# EasyEDA Pro project stripdriver.eprj

# Schematic Schematic
Board Name: StripDriverBoard; Create Date: 2024-08-19; Project Name: stripdriver; Schematic Name: Schematic; Update Date: 2024-09-09; Company: Krzysztof Strehlau; Drawn: Krzysztof Strehlau; Part Number: LSDR202409A; Reviewed: Krzysztof Strehlau; Version: R202408A
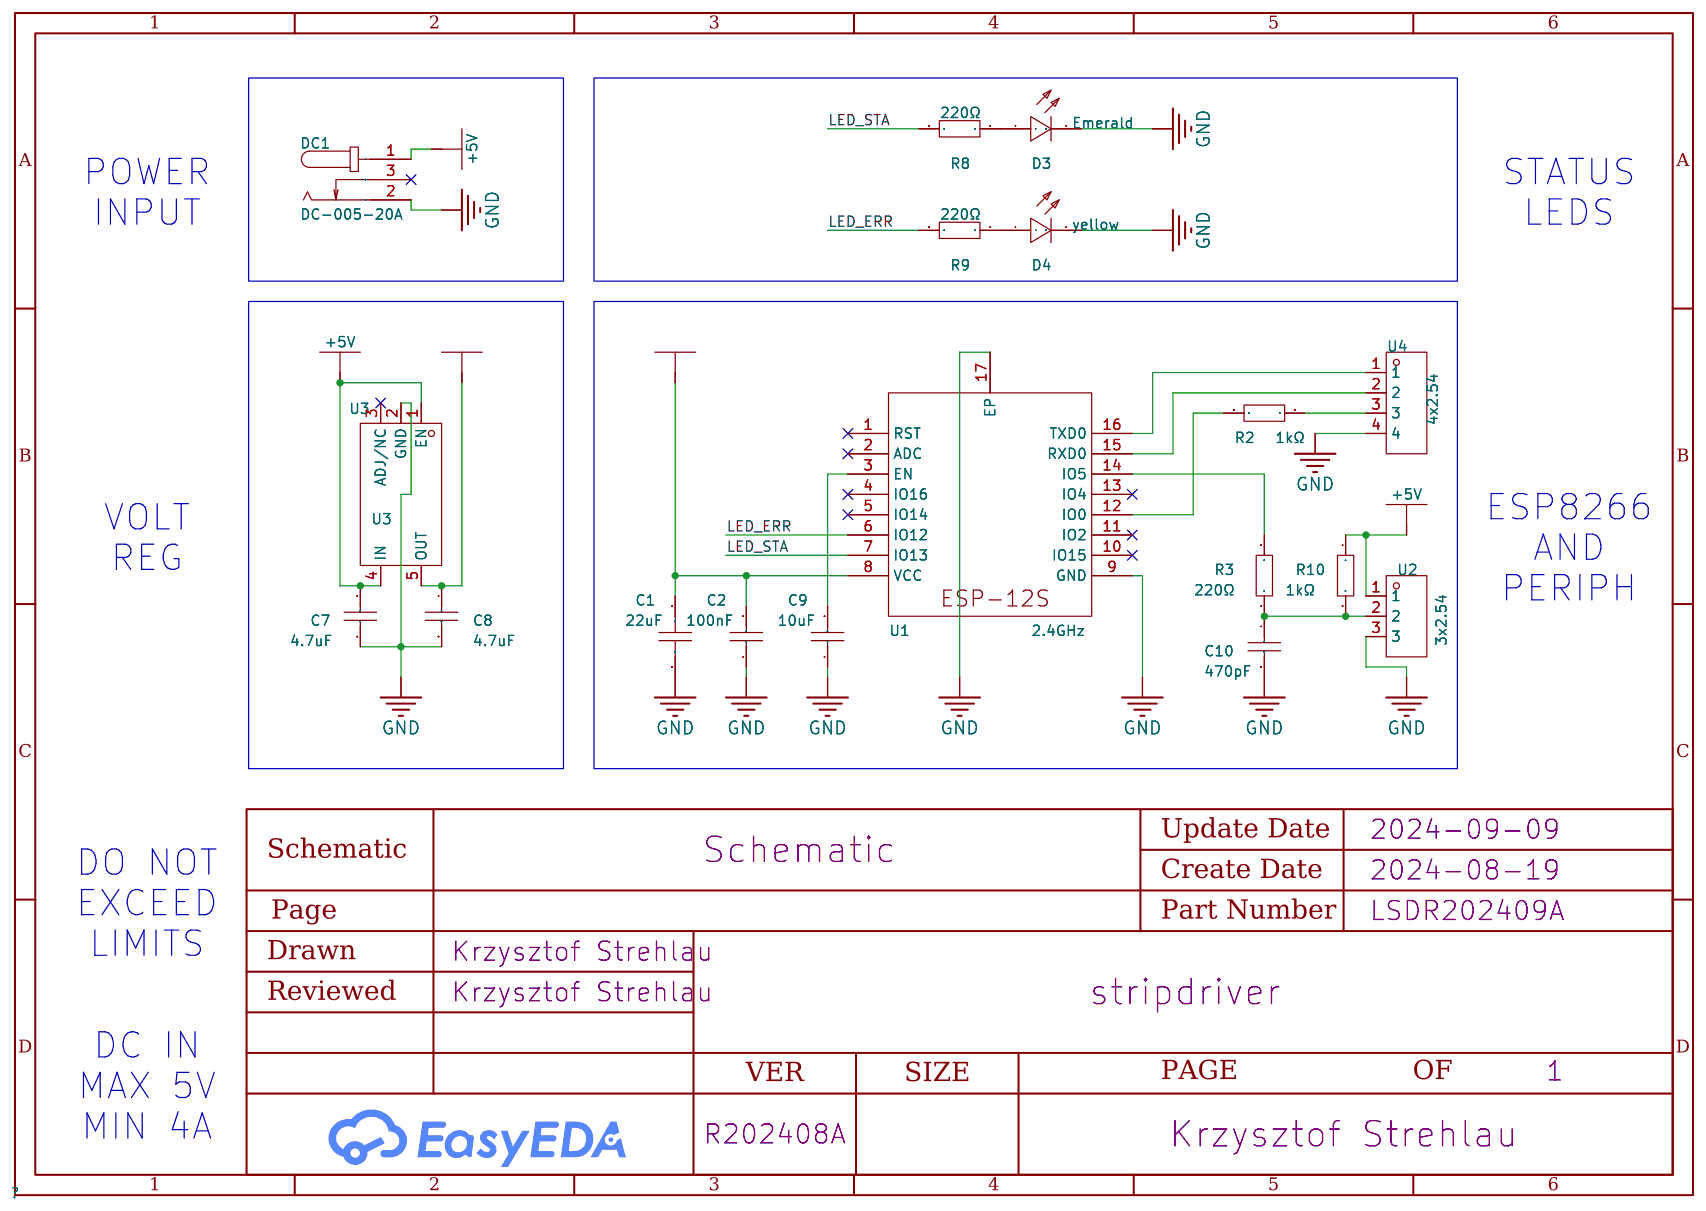
[diagram p0: schematic sheet]

## Parts
C1  22uF  [C0805]
C2  100nF  [C0603]
C7  4.7uF  [C0805]
C8  4.7uF  [C0805]
C9  10uF  [C0805]
C10  470pF  [C0603]
D3  Emerald  [LED0603-R-RD]
D4  yellow  [LED0603-R-RD]
DC1  DC-005-20A  [DC-IN-TH_DC005]
R2  1kΩ  [R0603]
R3  220Ω  [R0603]
R8  220Ω  [R0603]
R9  220Ω  [R0603]
R10  1kΩ  [R0603]
U1  2.4GHz  [WIRELM-SMD_ESP-12S]
U2  3x2.54  [CONN-TH_DB125-2.54-3P-GN]
U3  U3  [SOT-89-5_L4.5-W2.5-P1.50-LS4.5-BR]
U4  4x2.54  [CONN-TH_DB125-2.54-4P-GN]

## Library data of the parts
C1 = CL21A226MAQNNNE_C45783: Capacitance: Tolerance:±20% Tolerance:±20% Voltage Rated: Temperature Coefficient:; LCSC Part Name: 22uF ±20% 25V; Supplier Part: C45783; Manufacturer: SAMSUNG(三星); Manufacturer Part: CL21A226MAQNNNE; Supplier Footprint: 0805; JLCPCB Part Class: Basic Part; Datasheet: https://atta.szlcsc.com/upload/public/pdf/source/20160103/1457707727161.pdf; Supplier: LCSC; Tolerance: ±20%; Check: true
C2 C10 = CC0603KRX7R9BB104: Capacitance: Tolerance:±10% Tolerance:±10% Voltage Rated: Temperature Coefficient:; LCSC Part Name: 100nF ±10% 50V; Supplier Part: C14663; Manufacturer: YAGEO(国巨); Supplier Footprint: 0603; JLCPCB Part Class: Basic Part; Datasheet: https://atta.szlcsc.com/upload/public/pdf/source/20170116/1484561234239.pdf; Supplier: LCSC; Tolerance: ±10%; Check: true
C7-C9 = CL21A475KAQNNNE: Capacitance: Tolerance:±10% Tolerance:±10% Voltage Rated: Temperature Coefficient:; LCSC Part Name: 4.7uF ±10% 25V; Supplier Part: C1779; Manufacturer: SAMSUNG(三星); Supplier Footprint: 0805; JLCPCB Part Class: Basic Part; Datasheet: https://atta.szlcsc.com/upload/public/pdf/source/20160103/1457707696447.pdf; Supplier: LCSC; Tolerance: ±10%; Check: true
D3 = 19-217/GHC-YR1S2/3T: LCSC Part Name: 翠绿 520nm~535nm; Supplier Part: C72043; Manufacturer: EVERLIGHT(亿光); Supplier Footprint: 0603; JLCPCB Part Class: Basic Part; Datasheet: https://atta.szlcsc.com/upload/public/pdf/source/20160507/1462613613780.pdf; Supplier: LCSC; Lens Color: Colorless transparence; Dominant Wavelength: 520nm~535nm; Peak Wavelength: 518nm; Forward Current: 20mA; Power Dissipation: 110mW; Viewing Angle: 120°; Operating Temperature: -40℃~+85℃; Check: true
D4 = 19-213/Y2C-CQ2R2L/3T(CY): Emitted Color:yellow Diode Configuration:- Lens Color:Colorless transparence Dominant Wavelength:585.5nm~591.5nm Dominant Wavelength:585.5nm~591.5nm Peak Wavelength:591nm Color Temperature:- Color Temperature:- Forward Current:20mA Power Dissipation:60mW; LCSC Part Name: 黄灯 585.5nm~591.5nm; Supplier Part: C72038; Manufacturer: EVERLIGHT(亿光); Supplier Footprint: 0603; JLCPCB Part Class: Basic Part; Datasheet: https://atta.szlcsc.com/upload/public/pdf/source/20160507/1462613613586.pdf; Supplier: LCSC; Lens Color: Colorless transparence; Dominant Wavelength: 585.5nm~591.5nm; Peak Wavelength: 591nm; Forward Current: 20mA; Power Dissipation: 60mW; Viewing Angle: 120°; Operating Temperature: -40℃~+85℃; Check: true
DC1 = DC-005-20A: Inside Contact Diameter:2mm Outside Contact Diameter:6.4mm Current Rating (Max):500mA Voltage Rating (Max):30V; LCSC Part Name: 内径:2mm 外径:6.4mm; Supplier Part: C130239; Manufacturer: 韩国韩荣; Supplier Footprint: 插件; JLCPCB Part Class: Extended Part; Datasheet: https://atta.szlcsc.com/upload/public/pdf/source/20210810/D1FE451D887B1804F0660F580C4AD849.pdf; Supplier: LCSC; Inside Contact Diameter: 2mm; Outside Contact Diameter: 6.4mm; Current Rating (Max): 500mA; Voltage Rating (Max): 30V
R2 = 0603WAF1001T5E: Type:Thick Film Resistors Resistance:1kΩ Tolerance:±1% Tolerance:±1% Power(Watts): Overload Voltage (Max): Temperature Coefficient:±100ppm/℃ Temperature Coefficient:±100ppm/℃ Operating Temperature Range:-55℃~+155℃ Operating Temperature Range:-55℃~+155℃; LCSC Part Name: 1kΩ ±1% 100mW 厚膜电阻; Supplier Part: C21190; Manufacturer: UNI-ROYAL(厚声); Supplier Footprint: 0603; JLCPCB Part Class: Basic Part; Datasheet: https://atta.szlcsc.com/upload/public/pdf/source/20200306/C422600_1E6D84923E4A46A82E41ADD87F860B5C.pdf; Supplier: LCSC; Type: Thick Film Resistors; Tolerance: ±1%; Temperature Coefficient: ±100ppm/℃; Operating Temperature Range: -55℃~+155℃; Check: true
R3 R10 = 0603WAF1002T5E: Type:Thick Film Resistors Resistance: Tolerance:±1% Tolerance:±1% Power(Watts): Temperature Coefficient:±100ppm/℃ Temperature Coefficient:±100ppm/℃ Overload Voltage (Max): Operating Temperature Range:-55℃~+155℃ Operating Temperature Range:-55℃~+155℃; LCSC Part Name: 10kΩ ±1% 100mW; Supplier Part: C25804; Manufacturer: UNI-ROYAL(厚声); Supplier Footprint: 0603; JLCPCB Part Class: Basic Part; Datasheet: https://atta.szlcsc.com/upload/public/pdf/source/20200306/C422600_1E6D84923E4A46A82E41ADD87F860B5C.pdf; Supplier: LCSC; Type: Thick Film Resistors; Tolerance: ±1%; Temperature Coefficient: ±100ppm/℃; Operating Temperature Range: -55℃~+155℃; Check: true
R8 R9 = 0603WAF2200T5E: Type:Thick Film Resistors Resistance: Tolerance:±1% Tolerance:±1% Power(Watts): Temperature Coefficient:±100ppm/℃ Temperature Coefficient:±100ppm/℃ Overload Voltage (Max): Operating Temperature Range:-55℃~+155℃ Operating Temperature Range:-55℃~+155℃; LCSC Part Name: 220Ω ±1% 100mW; Supplier Part: C22962; Manufacturer: UNI-ROYAL(厚声); Supplier Footprint: 0603; JLCPCB Part Class: Basic Part; Datasheet: https://atta.szlcsc.com/upload/public/pdf/source/20200306/C422600_1E6D84923E4A46A82E41ADD87F860B5C.pdf; Supplier: LCSC; Type: Thick Film Resistors; Tolerance: ±1%; Temperature Coefficient: ±100ppm/℃; Operating Temperature Range: -55℃~+155℃; Check: true
U1 = ESP-12S: Core Processor:ESP8266芯片 Wireless Standard:802.11b/g/n；IP；TCP Support Interface:GPIO；UART；PWM；ADC Frequency:2.4GHz Antenna Type:板载PCBAntenna Output Power:16dBm Output Power:16dBm Operating Voltage:3.3V Operating Voltage:3.3V Receive  Current:56mA Send  Cu; Supplier Part: C82898; Manufacturer: Ai-Thinker(安信可); Supplier Footprint: SMD,16x24mm; JLCPCB Part Class: Extended Part; Datasheet: https://atta.szlcsc.com/upload/public/pdf/source/20180726/C82898_9FA1708C134FC93491C81360A8B073B0.pdf; Supplier: LCSC; Core Processor: ESP8266芯片; Wireless Standard: 802.11b/g/n；IP；TCP; Support Interface: GPIO；UART；PWM；ADC; Antenna Type: 板载PCBAntenna; Output Power: 16dBm; Operating Voltage: 3.3V; Receive  Current: 56mA; Send  Current: 170mA; Sensitivity: -90dBm; Operating Temperature: -20℃~+85℃
U2 = DB125-2.54-3P-GN-S: Pitch:2.54mm Number of Rows:1 Number of PINs Per Row:3 Mounting Style:直针 Current Rating (Max):8A Voltage Rating (Max):130V Wire Gauge - AWG:18~26 Wire Gauge - AWG:18~26 Wire Gauge - mm2:0.5~1 Wire Gauge - mm2:0.5~1 Operating Temperature Range:-40℃~+105℃ O; LCSC Part Name: 2.54mm 排数:1 每排P数:3 直针; Supplier Part: C918121; Manufacturer: DIBO(地博电气); Supplier Footprint: 插件,P=2.54mm; JLCPCB Part Class: Extended Part; Datasheet: https://atta.szlcsc.com/upload/public/pdf/source/20201111/C918120_C9DB7F6F3DB366529A80D61CABEEDAE6.pdf; Supplier: LCSC; Pitch: 2.54mm; Number of Rows: 1; Number of PINs Per Row: 3; Mounting Style: 直针; Current Rating (Max): 8A; Voltage Rating (Max): 130V; Wire Gauge - AWG: 18~26; Wire Gauge - mm2: 0.5~1; Operating Temperature Range: -40℃~+105℃; Check: true
U3 = AP7361C-33Y5-13: Output Type: Output Polarity:Positive Number of Outputs:1 Maximum Input Voltage:6V Output Voltage:3.3V~3.3V Output Voltage:3.3V~3.3V Dropout Voltage:360mV@(1A) Output Current:1A Power Supply Rejection Ratio (PSRR):75dB@(1kHz),55dB@(10kHz); LCSC Part Name: 正 Vin=6V Vout=3.3V 1A 75dB; Supplier Part: C460397; Manufacturer: DIODES(美台); Supplier Footprint: SOT-89-5; JLCPCB Part Class: Extended Part; Datasheet: https://atta.szlcsc.com/upload/public/pdf/source/20191127/C460397_F4F6F327541BE4867462406DC5457012.pdf; Supplier: LCSC; Output Polarity: Positive; Number of Outputs: 1; Maximum Input Voltage: 6V; Output Voltage: 3.3V~3.3V; Dropout Voltage: 360mV@(1A); Output Current: 1A; Power Supply Rejection Ratio (PSRR): 75dB@(1kHz),55dB@(10kHz); Check: true
U4 = DB125-2.54-4P-GN-S: Structure:1x4P Pitch:2.54mm Color:Green Mounting Style:Straight Current Rating (Max):8A Voltage Rating (Max):130V Number of Pins:4P Number of Rows:1 Wire Gauge - AWG:18~26 Wire Gauge - AWG:18~26 Wire Gauge - mm2:0.5~1 Wire Gauge - mm2:0.5~1 Number of PINs; LCSC Part Name: 2.54mm 1x4P 排数:1 每排P数:4 直插; Supplier Part: C918122; Manufacturer: DORABO(地博电气); Supplier Footprint: 插件,P=2.54mm; JLCPCB Part Class: Extended Part; Datasheet: https://atta.szlcsc.com/upload/public/pdf/source/20230106/BCD3A0BE1EB95DC3E813F1745F022035.pdf; Supplier: LCSC; Structure: 1x4P; Pitch: 2.54mm; Color: Green; Mounting Style: Straight; Current Rating (Max): 8A; Voltage Rating (Max): 130V; Number of Pins: 4P; Number of Rows: 1; Wire Gauge - AWG: 18~26; Wire Gauge - mm2: 0.5~1; Number of PINs Per Row: 4; Operating Temperature Range: -40℃~+105℃

## Nets
+3.3V: C1.1 C2.2 C8.1 U1.8(VCC) U3.5(OUT)
+5V: C7.1 DC1.1 R10.1 U2.1 U3.1(EN) U3.4(IN)
GND: C1.2 C2.1 C7.2 C8.2 C9.1 C10.2 D3.2(C) D4.2(C) DC1.2 U1.9(GND) U1.17(EP) U2.3 U3.2(GND) U4.4
LED_ERR: R9.2 U1.6(IO12)
LED_STA: R8.2 U1.7(IO13)
$1N637: C9.2 U1.3(EN)
$1N699: R2.1 U1.12(IO0)
$1N828: U1.15(RXD0) U4.2
$1N846: U1.16(TXD0) U4.1
$1N1187: C10.1 R3.1 R10.2 U2.2
$1N1252: R2.2 U4.3
$1N1491: D3.1(A) R8.1
$1N2027: D4.1(A) R9.1
$1N7231: R3.2 U1.14(IO5)

Not connected (* = marked no-connect by the designer): DC1 3*; U1 1(RST)* 2(ADC)* 4(IO16)* 5(IO14)* 10(IO15)* 11(IO2)* 13(IO4)*; U3 3(ADJ/NC)*

## Notes on the sheet
- POWER
  INPUT
- STATUS
  LEDS
- ESP8266
  AND
  PERIPH
- VOLT
  REG
- DO NOT
  EXCEED
  LIMITS
- DC IN
  MAX 5V
  MIN 4A

# Board PCB
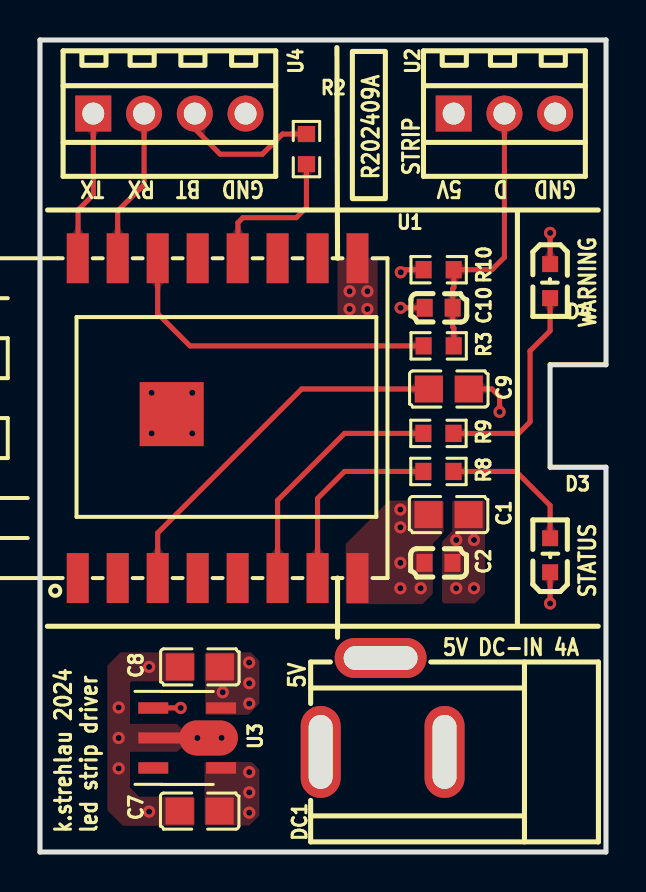
[diagram p1: board, top side]
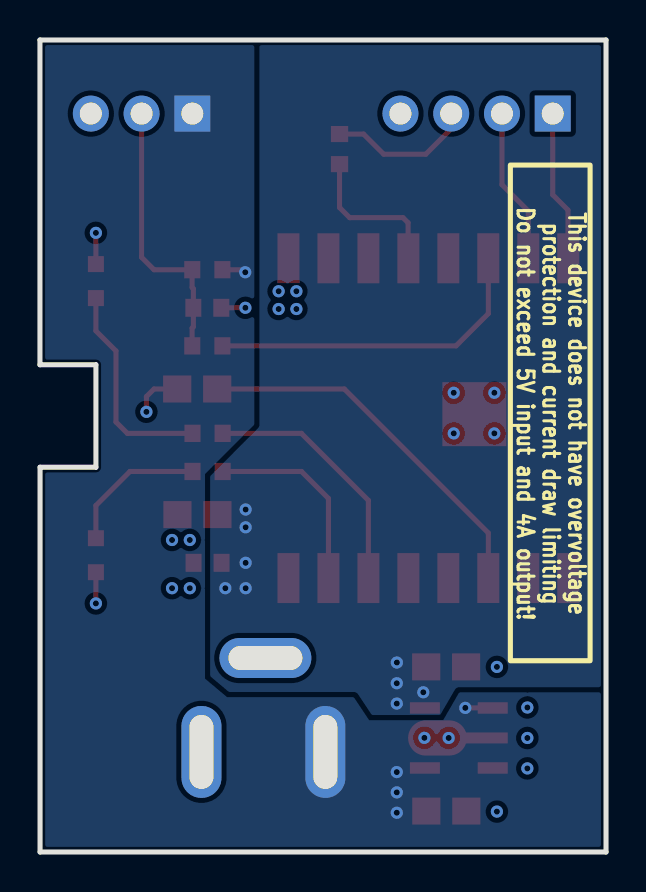
[diagram p2: board, bottom side, seen from below]

Outline 28.33 x 40.63 mm; copper layers: Top Layer, Inner1, Inner2, Bottom Layer. Coordinates in mm from the lower left corner of the outline.
Outline path: 0,40.63 28.33,40.63 28.33,24.38 25.53,24.38 25.53,19.25 28.32,19.25 28.32,0 0,0 0,40.63
Stack: Top Layer 0.035mm 外层铜厚1oz / Dielectric1 0.2104mm 7628 RC49% 8.6mil / Inner1 0.0152mm 内层铜厚 / Dielectric2 1.065mm 1.1mm H/HOZ 含铜 / Inner2 0.0152mm 内层铜厚 / Dielectric3 0.2104mm 7628 RC49% 8.6mil / Bottom Layer 0.035mm 外层铜厚1oz

## Design rules (mm)
template: Custom Config
spacing copperThickness1oz (default): track to track 0.102, other pairs 0.152 to 0.3
spacing copperThickness2oz: track to track 0.203, other pairs 0.152 to 0.3
track width copperThickness1oz (default): min 0.127, default 0.254, max 2.54
track width copperThickness2oz: min 0.203, default 0.254, max 2.54
differential pair differentialPair (default): width min 0.127, default 0.254, max 2.54; gap min 0.152, default 0.152
via viaSize (default): diameter min 0.5, default 0.61, max 10; hole min 0.3, default 0.305, max 6.3

## Placement (name value [footprint] x y rotation side)
C1  22uF  [C0805]  20.45 16.88 0 top
C2  100nF  [C0603]  19.94 14.47 180 top
C7  4.7uF  [C0805]  7.99 2.05 180 top
C8  4.7uF  [C0805]  8 9.26 180 top
C9  10uF  [C0805]  20.46 23.17 180 top
C10  470pF  [C0603]  19.95 27.23 180 top
D3  Emerald  [LED0603-R-RD]  25.53 14.85 90 top
D4  yellow  [LED0603-R-RD]  25.53 28.57 270 top
DC1  DC-005-20A  [DC-IN-TH_DC005]  17.15 7.36 180 top
R2  1kΩ  [R0603]  13.34 35.17 90 top
R3  220Ω  [R0603]  19.95 25.33 180 top
R8  220Ω  [R0603]  19.94 19.04 180 top
R9  220Ω  [R0603]  19.94 20.95 180 top
R10  1kΩ  [R0603]  19.95 29.14 0 top
U1  2.4GHz  [WIRELM-SMD_ESP-12S]  8.89 21.71 90 top
U2  3x2.54  [CONN-TH_DB125-2.54-3P-GN]  23.24 36.95 0 top
U3  U3  [SOT-89-5_L4.5-W2.5-P1.50-LS4.5-BR]  7.37 5.71 180 top
U4  4x2.54  [CONN-TH_DB125-2.54-4P-GN]  6.48 36.95 0 top

## Footprints (pads in the part's own frame, mm; a bottom-side part is the same pattern mirrored in y, then rotated)
C0603
  rect 0.8x0.9 smd: 1(-0.7,0) 2(0.7,0)
C0805
  rect 1.41x1.35 smd: 1(-1,0) 2(1,0)
CONN-TH_DB125-2.54-3P-GN
  rect 1.8x1.8 hole 1.1: 1(-2.54,0)
  round 1.8 hole 1.1: 2(0,0) 3(2.54,0)
CONN-TH_DB125-2.54-4P-GN
  rect 1.8x1.8 hole 1.1: 1(-3.81,0)
  round 1.8 hole 1.1: 2(-1.27,0) 3(1.27,0) 4(3.81,0)
DC-IN-TH_DC005
  oval 2x4.6 hole 1.2x3.7: 1(3.1,2.35) 2(-3.1,2.35)
  oval 4.6x2 hole 3.7x1.2: 3(0.1,-2.35)
LED0603-R-RD
  rect 0.8x0.8 smd: 1(0.851,0) 2(-0.851,0)
R0603
  rect 0.806x0.864 smd: 1(-0.753,0) 2(0.753,0)
SOT-89-5_L4.5-W2.5-P1.50-LS4.5-BR
  rect 1.5x0.574 smd: 1(1.698,-1.5) 3(1.698,1.5) 4(-1.698,1.5) 5(-1.698,-1.5)
  oval 2.94x1.76 smd: 2(-1.067,0)
  rect 2.209x0.552 smd: 2(1.343,0)
WIRELM-SMD_ESP-12S
  rect 2.5x1.1 smd: 1(-8.002,7) 2(-8.002,5) 3(-8,3) 4(-8.002,1) 5(-8.002,-1) 6(-8.002,-3) 7(-8.002,-5) 8(-8.001,-7) 9(8.001,-7) 10(8,-5) 11(8.001,-3) 12(8,-1) 13(8.001,1) 14(8.002,3) 15(8.001,5) 16(8,7)
  rect 3.2x3.2 smd: 17(0.2,2.3)

## Nets
As in the schematic.

Pads without a net: DC1 3; U1 1 2 4 5 10 11 13; U3 3

## Via types
v1: diameter 0.61, hole 0.305, Top Layer to Bottom Layer, 37 vias

## Routing (per net, layer and track width the routed paths; a pad name or vN(x,y) marks a point on that pad's centre or on a via; arc(x,y) is an arc through that point)
+3.3V:
  vias: v1(9.14,7.99) v1(10.47,9.48) v1(10.47,8.44) v1(10.47,7.43) v1(18.03,17.14) v1(18.03,16.25) v1(18.03,14.47) v1(18.03,13.2) v1(19.05,13.2)
+5V: length 2.5
  Top Layer w0.254: 5.73,7.21 v1(7.04,7.21) ; R10.1 18.18,29.14 v1(18.05,29.01)
  vias: v1(10.47,4) v1(10.47,2.98) v1(10.47,1.97)
GND: length 6.8
  Top Layer w0.254: v1(25.53,12.44) D3.2 ; C9.1 22.62,23.17 23,22.79 v1(23,22.03) ; C10.2 v1(18.05,27.23) ; v1(25.53,30.98) D4.2
  vias: v1(3.94,7.23) v1(3.94,5.71) v1(3.94,4.18) v1(5.46,9.26) v1(5.46,2.02) v1(5.59,22.98) v1(5.59,20.95) v1(7.62,22.98) v1(7.62,20.95) v1(7.87,5.71) v1(9.09,5.71) v1(15.49,28.06) v1(15.49,27.17) v1(16.38,28.06) v1(16.38,27.17) v1(20.83,15.61) v1(20.83,13.2) v1(21.72,15.61) v1(21.72,13.2)
LED_ERR: length 12.6
  Top Layer w0.254: R9.2 15.24,20.95 11.89,17.6 U1.6
LED_STA: length 9.8
  Top Layer w0.254: R8.2 15.24,19.04 13.89,17.69 U1.7
$1N637: length 18.8
  Top Layer w0.254: C9.2 13.09,23.17 5.89,15.97 U1.3
$1N699: length 7.7
  Top Layer w0.254: R2.1 13.34,32.25 12.83,31.74 10.16,31.74 9.91,31.49 9.91,29.73 U1.12
$1N828: length 7.8
  Top Layer w0.254: 3.89,29.71 3.89,32.08 5.21,33.39 U4.2
$1N846: length 7.6
  Top Layer w0.254: U1.16 1.91,29.72 1.91,32.12 2.67,32.89 U4.1
$1N1187: length 13.9
  Top Layer w0.254: R3.1 20.71,25.34 20.71,26.22 20.65,26.28 C10.1 20.65,28.19 20.71,28.25 20.71,29.13 R10.2 22.62,29.14 23.24,29.76 U2.2
$1N1252: length 7.3
  Top Layer w0.254: U4.3 7.75,36.19 9.02,34.92 11.13,34.92 12.13,35.92 R2.2
$1N1491: length 7.2
  Top Layer w0.254: R8.1 23.82,19.04 25.53,17.34 D3.1
$1N2027: length 10.7
  Top Layer w0.254: R9.1 23.95,20.95 24.52,21.52 24.52,25.07 25.53,26.08 D4.1
$1N7231: length 16.7
  Top Layer w0.254: R3.2 7.5,25.33 5.89,26.94 U1.14

## Copper pours and planes (outline as drawn; the poured copper is in the pictures)
+3.3V on Top Layer: 8.24,9.99 8.24,8.52 8.26,8.44 8.26,6.86 10.44,6.87 10.98,7.44 10.98,9.57 10.55,9.99
+3.3V on Top Layer: 20.21,17.47 20.17,17.56 20.08,17.59 17.53,17.59 17.48,17.58 17.44,17.56 15.33,15.45 15.3,15.41 15.29,15.36 15.29,12.53 15.33,12.44 15.42,12.41 19.09,12.41 19.14,12.42 19.18,12.44 19.62,12.88 19.65,12.92 19.66,12.97 19.66,15.38 19.67,15.43 19.7,15.47 20.17,15.95 20.2,15.99 20.21,16.04
+3.3V on Bottom Layer: -0.13,40.63 21.72,40.63 21.72,5.58 -0.13,5.58
+5V on Top Layer: 8.23,4.51 8.23,1.33 10.48,1.33 10.98,1.83 10.98,4.13 10.6,4.51
+5V on Bottom Layer: 7.34,7.99 0,7.99 0,-0.22 28.33,-0.13 28.33,40.63 17.6,40.63 17.6,21.38 20.07,18.92 20.07,8.68 18.96,7.75 12.62,7.75 11.85,6.6 8.15,6.6
GND on Top Layer: 14.89,29.71 14.89,26.64 16.9,26.64 16.9,29.71
GND on Top Layer: 20.63,17.47 20.66,17.56 20.75,17.59 22.15,17.59 22.2,17.58 22.27,17.51 22.28,17.47 22.28,13 22.27,12.95 22.24,12.91 21.81,12.48 21.77,12.45 21.72,12.44 20.25,12.44 20.16,12.48 20.12,12.57 20.12,15.5 20.13,15.55 20.16,15.59 20.59,16.02 20.62,16.06 20.63,16.11
GND on Top Layer: 4.14,1.31 3.37,2.08 3.37,9.33 4.03,9.99 7.76,9.99 7.76,8.54 4.6,8.54 4.5,8.44 4.5,6.41 6.84,6.41 7.27,5.99 7.27,5.42 6.87,5.02 4.5,5.02 4.5,3.24 4.97,2.77 7.75,2.77 7.75,1.31
GND on Inner1: 0.26,40.38 28.07,40.38 28.07,0.26 0.26,0.26
GND on Inner2: 0.26,40.38 28.07,40.38 28.07,0.26 0.26,0.26

Small or netless copper shapes (teardrops, artwork), in the pictures only: 39 on Top Layer, 12 on Inner1, 12 on Inner2

## Text on the board
Bottom Silkscreen Layer: This device does not have overvoltage / protection and current draw limiting / Do not exceed 5V input and 4A output!
Top Silkscreen Layer: k.strehlau 2024 / led strip driver | 5V DC-IN 4A | 5V | R202409A | STATUS | WARNING | TX | RX | BT | GND | D | STRIP
